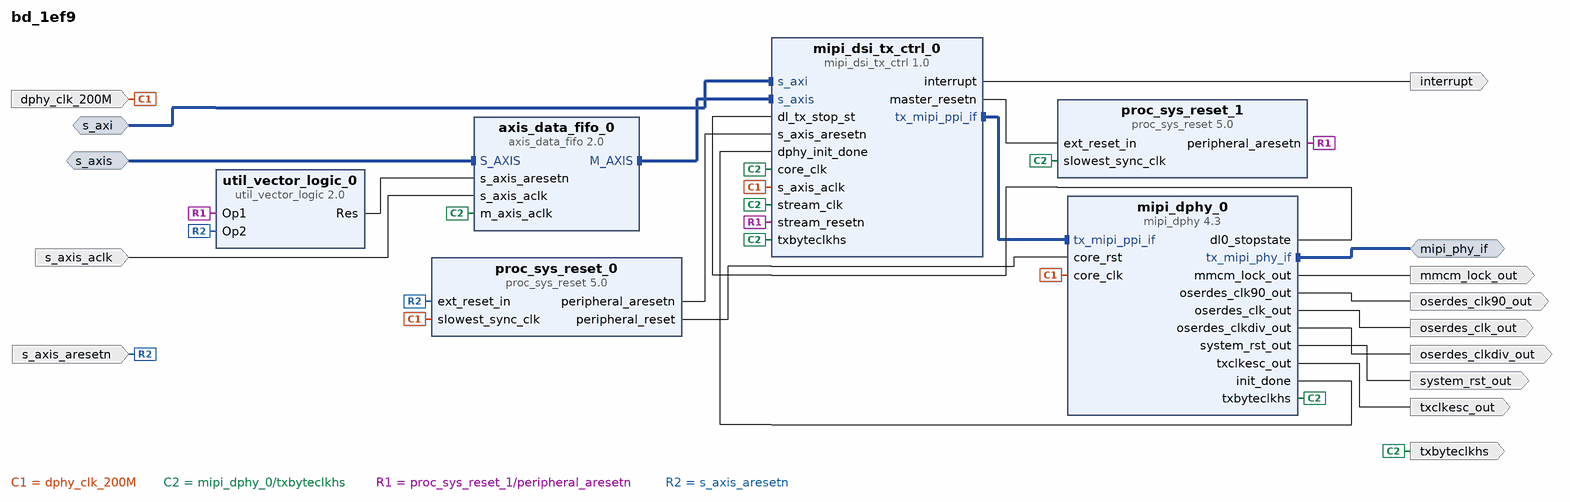
[diagram p0: block diagram of the top level]
# Vivado block design bd_1ef9, xc7z020clg484-2, Vivado 2024.1
create_bd_design bd_1ef9

create_bd_intf_port -mode Master -vlnv xilinx.com:interface:mipi_phy_rtl:1.0 mipi_phy_if
create_bd_intf_port -mode Slave -vlnv xilinx.com:interface:aximm_rtl:1.0 s_axi
set_property -dict {CONFIG.DATA_WIDTH 32 CONFIG.PROTOCOL AXI4LITE} [get_bd_intf_ports s_axi]
create_bd_intf_port -mode Slave -vlnv xilinx.com:interface:axis_rtl:1.0 s_axis
create_bd_port -dir I -type clk s_axis_aclk
set_property -dict {CONFIG.ASSOCIATED_BUSIF s_axis CONFIG.ASSOCIATED_RESET s_axis_aresetn} [get_bd_ports s_axis_aclk]
create_bd_port -dir I -type rst s_axis_aresetn
set_property -dict {CONFIG.POLARITY ACTIVE_LOW} [get_bd_ports s_axis_aresetn]
create_bd_port -dir I -type clk dphy_clk_200M
set_property -dict {CONFIG.ASSOCIATED_BUSIF s_axi} [get_bd_ports dphy_clk_200M]
create_bd_port -dir O -type clk txclkesc_out
create_bd_port -dir O -type clk oserdes_clk_out
create_bd_port -dir O -type clk oserdes_clk90_out
create_bd_port -dir O -type clk txbyteclkhs
create_bd_port -dir O -type clk oserdes_clkdiv_out
create_bd_port -dir O system_rst_out
create_bd_port -dir O mmcm_lock_out
create_bd_port -dir O -type intr interrupt

create_bd_cell -type ip -vlnv xilinx.com:ip:proc_sys_reset:5.0 proc_sys_reset_0
create_bd_cell -type ip -vlnv xilinx.com:ip:proc_sys_reset:5.0 proc_sys_reset_1
create_bd_cell -type ip -vlnv xilinx.com:ip:util_vector_logic:2.0 util_vector_logic_0
set_property -dict {CONFIG.C_OPERATION and CONFIG.C_SIZE 1} [get_bd_cells util_vector_logic_0]
create_bd_cell -type ip -vlnv xilinx.com:ip:axis_data_fifo:2.0 axis_data_fifo_0
set_property -dict [list \
  CONFIG.FIFO_DEPTH 32 \
  CONFIG.HAS_TKEEP 1 \
  CONFIG.HAS_TLAST 1 \
  CONFIG.HAS_TSTRB 0 \
  CONFIG.IS_ACLK_ASYNC 1 \
  CONFIG.TDATA_NUM_BYTES 12 \
  CONFIG.TDEST_WIDTH 0 \
  CONFIG.TID_WIDTH 0 \
  CONFIG.TUSER_WIDTH 1 \
] [get_bd_cells axis_data_fifo_0]
create_bd_cell -type ip -vlnv xilinx.com:ip:mipi_dsi_tx_ctrl:1.0 mipi_dsi_tx_ctrl_0
set_property -dict [list \
  CONFIG.C_DSI_INIT_DESKEW_PATRN_LEN 4096 \
  CONFIG.C_DSI_PERIODIC_CNTR_WIDTH 32 \
  CONFIG.C_DSI_PERIODIC_PATRN_LEN 4096 \
  CONFIG.C_DSI_PERIODIC_TIME 50 \
  CONFIG.C_DSI_XMIT_ALT_DESKEW false \
  CONFIG.C_DSI_XMIT_INITIAL_DESKEW false \
  CONFIG.C_DSI_XMIT_PERIODIC_DESKEW false \
  CONFIG.C_INCLUDE_CMD_MODE true \
  CONFIG.C_LINE_RATE 800 \
  CONFIG.C_MIPI_SLV_INT 0 \
  CONFIG.DSI_BYTE_FIFO 2048 \
  CONFIG.DSI_CRC_GEN true \
  CONFIG.DSI_DATATYPE RGB888 \
  CONFIG.DSI_LANES 4 \
  CONFIG.DSI_PIXELS 4 \
] [get_bd_cells mipi_dsi_tx_ctrl_0]
create_bd_cell -type ip -vlnv xilinx.com:ip:mipi_dphy:4.3 mipi_dphy_0
set_property -dict [list \
  CONFIG.C_DPHY_LANES 4 \
  CONFIG.C_DPHY_MODE MASTER \
  CONFIG.C_EN_7S_LINERATE_CHECK false \
  CONFIG.C_EN_DCTS_LOGIC false \
  CONFIG.C_EN_HS_OBUFTDS false \
  CONFIG.C_EN_REG_IF false \
  CONFIG.C_EN_SSC false \
  CONFIG.C_ESC_CLK_PERIOD 20.000 \
  CONFIG.C_HS_LINE_RATE 800 \
  CONFIG.C_LPX_PERIOD 50 \
  CONFIG.C_SKEWCAL_FIRST_TIME 4096 \
  CONFIG.C_STRETCH_LINE_RATE 3200 \
  CONFIG.C_XMIT_ALT_DESKEW_SEQ false \
  CONFIG.C_XMIT_FIRST_DESKEW_SEQ false \
  CONFIG.C_XMIT_PERIODIC_DESKEW_SEQ false \
  CONFIG.DPHY_PRESET None \
  CONFIG.SupportLevel 1 \
] [get_bd_cells mipi_dphy_0]

# ---- connections ----

connect_bd_intf_net [get_bd_intf_pins axis_data_fifo_0/M_AXIS] [get_bd_intf_pins mipi_dsi_tx_ctrl_0/s_axis]
connect_bd_intf_net [get_bd_intf_ports mipi_phy_if] [get_bd_intf_pins mipi_dphy_0/tx_mipi_phy_if]
connect_bd_intf_net [get_bd_intf_pins mipi_dsi_tx_ctrl_0/tx_mipi_ppi_if] [get_bd_intf_pins mipi_dphy_0/tx_mipi_ppi_if]
connect_bd_intf_net [get_bd_intf_pins mipi_dsi_tx_ctrl_0/s_axi] [get_bd_intf_ports s_axi]
connect_bd_intf_net [get_bd_intf_ports s_axis] [get_bd_intf_pins axis_data_fifo_0/S_AXIS]
connect_bd_net [get_bd_ports dphy_clk_200M] \
  [get_bd_pins proc_sys_reset_0/slowest_sync_clk] [get_bd_pins mipi_dsi_tx_ctrl_0/s_axis_aclk] \
  [get_bd_pins mipi_dphy_0/core_clk]
connect_bd_net [get_bd_pins mipi_dphy_0/dl0_stopstate] [get_bd_pins mipi_dsi_tx_ctrl_0/dl_tx_stop_st]
connect_bd_net [get_bd_pins mipi_dphy_0/init_done] [get_bd_pins mipi_dsi_tx_ctrl_0/dphy_init_done]
connect_bd_net [get_bd_pins mipi_dphy_0/mmcm_lock_out] [get_bd_ports mmcm_lock_out]
connect_bd_net [get_bd_pins mipi_dphy_0/oserdes_clk90_out] [get_bd_ports oserdes_clk90_out]
connect_bd_net [get_bd_pins mipi_dphy_0/oserdes_clk_out] [get_bd_ports oserdes_clk_out]
connect_bd_net [get_bd_pins mipi_dphy_0/oserdes_clkdiv_out] [get_bd_ports oserdes_clkdiv_out]
connect_bd_net [get_bd_pins mipi_dphy_0/system_rst_out] [get_bd_ports system_rst_out]
connect_bd_net [get_bd_pins mipi_dphy_0/txbyteclkhs] \
  [get_bd_pins mipi_dsi_tx_ctrl_0/txbyteclkhs] [get_bd_ports txbyteclkhs] [get_bd_pins mipi_dsi_tx_ctrl_0/core_clk] \
  [get_bd_pins axis_data_fifo_0/m_axis_aclk] [get_bd_pins mipi_dsi_tx_ctrl_0/stream_clk] \
  [get_bd_pins proc_sys_reset_1/slowest_sync_clk]
connect_bd_net [get_bd_pins mipi_dphy_0/txclkesc_out] [get_bd_ports txclkesc_out]
connect_bd_net [get_bd_pins mipi_dsi_tx_ctrl_0/interrupt] [get_bd_ports interrupt]
connect_bd_net [get_bd_pins mipi_dsi_tx_ctrl_0/master_resetn] [get_bd_pins proc_sys_reset_1/ext_reset_in]
connect_bd_net [get_bd_pins proc_sys_reset_0/peripheral_aresetn] [get_bd_pins mipi_dsi_tx_ctrl_0/s_axis_aresetn]
connect_bd_net [get_bd_pins proc_sys_reset_0/peripheral_reset] [get_bd_pins mipi_dphy_0/core_rst]
connect_bd_net [get_bd_pins proc_sys_reset_1/peripheral_aresetn] [get_bd_pins util_vector_logic_0/Op1] [get_bd_pins mipi_dsi_tx_ctrl_0/stream_resetn]
connect_bd_net [get_bd_ports s_axis_aclk] [get_bd_pins axis_data_fifo_0/s_axis_aclk]
connect_bd_net [get_bd_ports s_axis_aresetn] [get_bd_pins proc_sys_reset_0/ext_reset_in] [get_bd_pins util_vector_logic_0/Op2]
connect_bd_net [get_bd_pins util_vector_logic_0/Res] [get_bd_pins axis_data_fifo_0/s_axis_aresetn]

# ---- address map ----
assign_bd_address -offset 0x00000000 -range 64K -target_address_space [get_bd_addr_spaces s_axi] [get_bd_addr_segs mipi_dsi_tx_ctrl_0/s_axi/reg0]

validate_bd_design
save_bd_design
